# Altium project rf_detector.PrjPcb (part 1 of 4)
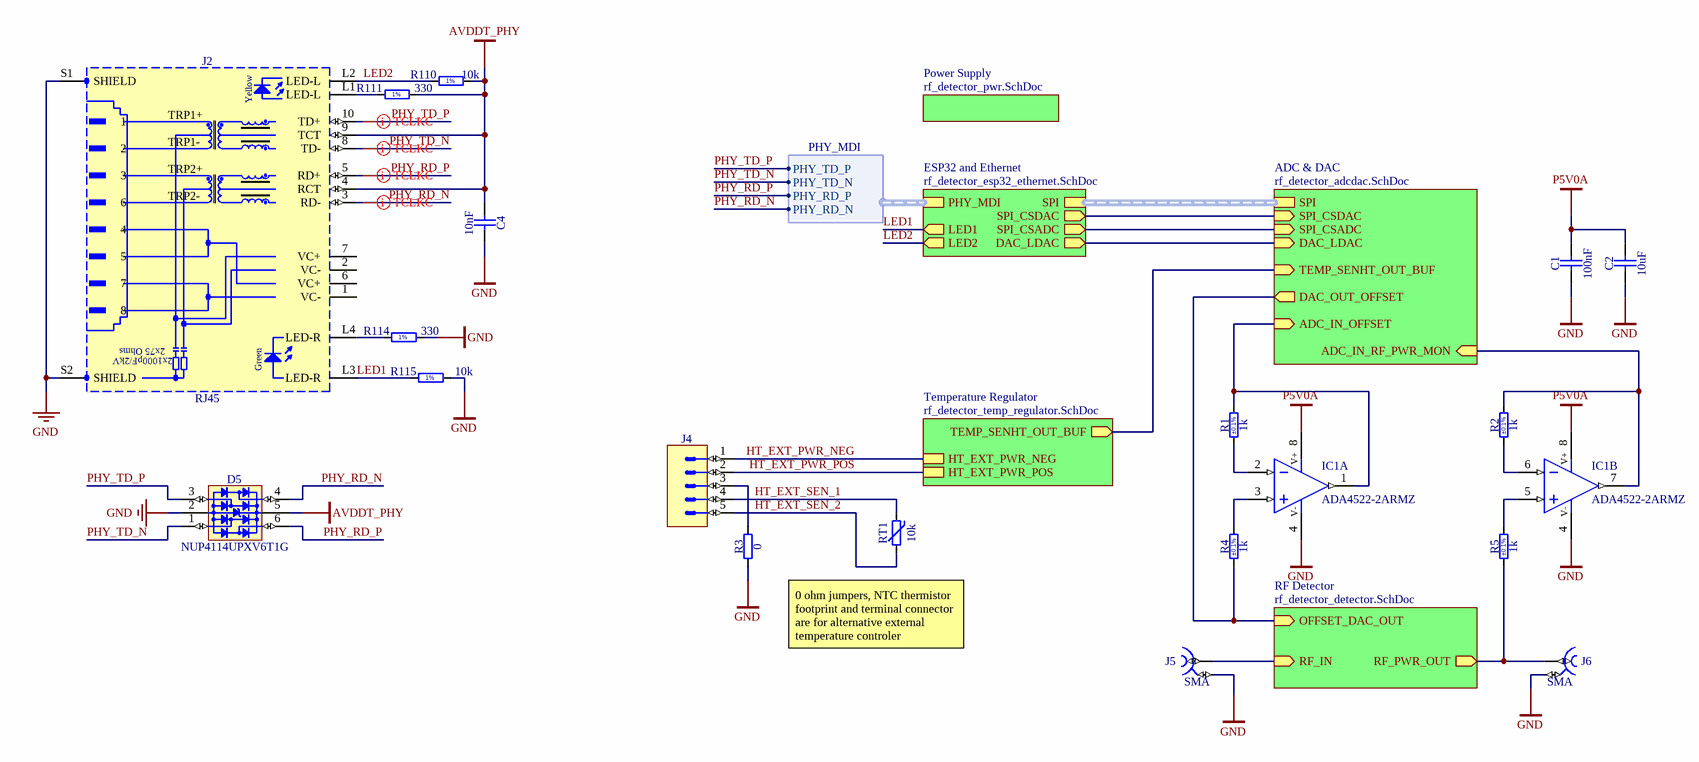
[diagram p0: rf_detector_top.SchDoc]
6 sheets, 329 parts. Net scope: hierarchical (ports join the sheet entries above them; power ports are global).
Board file: rf_detector.PcbDoc
Sheets:
  rf_detector_top.SchDoc
    ADC & DAC = rf_detector_adcdac.SchDoc
    RF Detector = rf_detector_detector.SchDoc
    ESP32 and Ethernet = rf_detector_esp32_ethernet.SchDoc
    Power Supply = rf_detector_pwr.SchDoc
    Temperature Regulator = rf_detector_temp_regulator.SchDoc

## Sheet rf_detector_top.SchDoc: SPE Router
size 420 x 297 mm; Author: P. Daniel; CompanyName: WUT ISE; DrawnBy: P. Daniel; Organization: WUT ISE; Address1: WUT ISE; Address2: Nowowiejska 15/19 00-665 Warsaw; Address3: piotrmaciejdaniel@gmail.com; Revision: 1; SheetNumber: 1; SheetTotal: 6; ModifiedBy: -; CreateDate: 02-03.2023; CheckedDate: -; Title2: top schematic; DivGrp: WUT ISE; Designer: Piotr Daniel

### Parts
C1  100nF  [CAPC1005X55N]
C2  10uF  [CAPC2012X135N]
C4  10nF  [CAPC1608X87N]
D5  NUP4114UPXV6T1G  [SOTFL50P160X60-6N]
IC1  ADA4522-2ARMZ  [SOP65P490X110-8N]  (parts A,B of 2)
J2  RJ45  [ABRACON_ARJM11C7-114-BA-EW2]
J4  (no value)  [PHOENIX_1803303]
J5  SMA  [MOLEX_73251-2121]
J6  SMA  [MOLEX_73251-2121]
R1  1k  Tolerance: ±0.1%  [RESC1608X55N]
R2  1k  Tolerance: ±0.1%  [RESC1608X55N]
R3  0  [RESC2012X60N]
R4  1k  Tolerance: ±0.1%  [RESC1608X55N]
R5  1k  Tolerance: ±0.1%  [RESC1608X55N]
R110  10k  [RESC1005X40N]
R111  330  [RESC1005X40N]
R114  330  [RESC1005X40N]
R115  10k  [RESC1005X40N]
RT1  10k  [THERMC1608X90N]

### Sub-sheets
ADC & DAC = rf_detector_adcdac.SchDoc: TEMP_SENHT_OUT_BUF (in), DAC_OUT_OFFSET (out), ADC_IN_OFFSET (in), ADC_IN_RF_PWR_MON (in), SPI (harness PHY_MDI), SPI_CSDAC (in), SPI_CSADC (in), DAC_LDAC (in)
ESP32 and Ethernet = rf_detector_esp32_ethernet.SchDoc: SPI_CSDAC (out), SPI_CSADC (out), DAC_LDAC (out), PHY_MDI (harness PHY_MDI), SPI (harness PHY_MDI), LED2 (out), LED1 (out)
Power Supply = rf_detector_pwr.SchDoc: no entries
RF Detector = rf_detector_detector.SchDoc: OFFSET_DAC_OUT (in), RF_IN (in), RF_PWR_OUT (out)
Temperature Regulator = rf_detector_temp_regulator.SchDoc: TEMP_SENHT_OUT_BUF (out), HT_EXT_PWR_POS, HT_EXT_PWR_NEG

### Harnesses
PHY_MDI: PHY_TD_P, PHY_TD_N, PHY_RD_P, PHY_RD_N

### Nets
AVDDT_PHY: C4.2 D5.5(VBUS) J2.4(RCT) J2.9(TCT) R110.1 R111.1
GND: C1.1 C2.1 C4.1 D5.2(GND) IC1.4(V-) J2.S1(SHIELD) J2.S2(SHIELD) J5.2 J6.2 R3.1 R114.1 R115.1
P5V0A: C1.2 C2.2 IC1.8(V+)
ADC_IN_OFFSET: IC1.1(OUT) R1.2 ; sheet ADC & DAC/ADC_IN_OFFSET
ADC_IN_RF_PWR_MON: IC1.7(OUT) R2.2 ; sheet ADC & DAC/ADC_IN_RF_PWR_MON
DAC_LDAC: sheet ADC & DAC/DAC_LDAC, sheet ESP32 and Ethernet/DAC_LDAC
DAC_OUT_OFFSET: R4.1 ; sheet ADC & DAC/DAC_OUT_OFFSET, sheet RF Detector/OFFSET_DAC_OUT
HT_EXT_PWR_NEG: J4.1 ; sheet Temperature Regulator/HT_EXT_PWR_NEG
HT_EXT_PWR_POS: J4.2 ; sheet Temperature Regulator/HT_EXT_PWR_POS
HT_EXT_SEN_1: J4.4 RT1.2
HT_EXT_SEN_2: J4.5 RT1.1
LED1: J2.L3(LED-R) R115.2 ; sheet ESP32 and Ethernet/LED1
LED2: J2.L2(LED-L) R110.2 ; sheet ESP32 and Ethernet/LED2
PHY_RD_N: D5.4(I/O3) J2.3(RD-) ; sheet ESP32 and Ethernet/PHY_MDI.PHY_RD_N
PHY_RD_P: D5.6(I/O4) J2.5(RD+) ; sheet ESP32 and Ethernet/PHY_MDI.PHY_RD_P
PHY_TD_N: D5.1(I/O1) J2.8(TD-) ; sheet ESP32 and Ethernet/PHY_MDI.PHY_TD_N
PHY_TD_P: D5.3(I/O2) J2.10(TD+) ; sheet ESP32 and Ethernet/PHY_MDI.PHY_TD_P
RF_IN: J5.1 ; sheet RF Detector/RF_IN
RF_PWR_OUT: J6.1 R5.1 ; sheet RF Detector/RF_PWR_OUT
SPI_CSADC: sheet ADC & DAC/SPI_CSADC, sheet ESP32 and Ethernet/SPI_CSADC
SPI_CSDAC: sheet ADC & DAC/SPI_CSDAC, sheet ESP32 and Ethernet/SPI_CSDAC
TEMP_SENHT_OUT_BUF: sheet ADC & DAC/TEMP_SENHT_OUT_BUF, sheet Temperature Regulator/TEMP_SENHT_OUT_BUF
NetIC1_2: IC1.2(IN-) R1.1
NetIC1_3: IC1.3(IN+) R4.2
NetIC1_5: IC1.5(IN+) R5.2
NetIC1_6: IC1.6(IN-) R2.1
NetJ2_L1: J2.L1(LED-L) R111.2
NetJ2_L4: J2.L4(LED-R) R114.2
NetJ4_3: J4.3 R3.2

Not connected (* = marked no-connect by the designer): J2 1(VC-) 2(VC-) 6(VC+) 7(VC+)

### Buses and harness runs
harness sheet ADC & DAC/SPI = sheet ESP32 and Ethernet/SPI

### Layout directives
differential pair; differential pair class Ethernet; net class Ethernet: PHY_RD_N, PHY_RD_P, PHY_TD_N, PHY_TD_P

### Notes on the sheet
- 0 ohm jumpers, NTC thermistor footprint and terminal connector are for alternative external temperature controler
- Project/Equipment
- Document
- Designer
- Drawn by
- Check.by
- Copyright WUT ISE 2021.
  This documentation describes Open Hardware and is licensed under the CERN OHL v.1.1. You may redistribute and modify this documentation under the terms of the CERN OHL v.1.1. (http://ohwr.org/CERNOHL). This documentation is distributed WITHOUT ANY EXPRESS OR IMPLIED WARRANTY, INCLUDING OF MERCHANTABILITY, SATISFACTORY QUALITY AND FITNESS FOR A PARTICULAR PURPOSE. Please see the CERN OHL v.1.1 for applicable conditions.
- Contact
- File
- Last Mod.
- Print Date
- Sheet
- Size
- A3
- of
- Rev
- (in symbol CON_ETH_POE_ARJM11C7) Yellow; TRP1+; TRP1-; TRP2+; TRP2-; 2x75 Ohms; Green; 2x1000pF/2kV
- (in symbol R0402_10K_1%_0.0625W_100PPM) 1%
- (in symbol R0402_330R_1%_0.0625W_100PPM) 1%

### Library data of the parts
C1 = CC0402_100NF_16V_10%_X7R: Non-polarised capacitor; Part Description: SMD Multilayer Chip Ceramic Capacitor; Manufacturer: GENERIC; Manufacturer1 Part Number: GRM155R71C104KA88D; Voltage: 16V; TC: X7R; Tolerance: ±10%; Part Number: CC0402_100NF_16V_10%_X7R; Component Kind: Standard; Component Type: Standard; Pin Count: 2; Value: 100nF; Status: Not Recommended; Manufacturer Part Number: CC0402_100NF_16V_10%_X7R; Case: 0402; Mounted: Yes; Socket: No; SMD: Yes; Sense: No; Manufacturer1 Example: MURATA; Manufacturer1 ComponentHeight: 0.55mm; HelpURL: \\cern.ch\dfs\Applications\Altium\Datasheets\CC0402_X7R_MURATA_GRM.pdf; Author: CERN DEM JLC; CreateDate: 05.12.2013; LatestRevisionDate: 03.12.2007
C2 = CC0805_10UF_10V_10%_X7R: Non-polarised capacitor; Part Description: SMD Multilayer Chip Ceramic Capacitor; Manufacturer: GENERIC; Manufacturer1 Part Number: GRM21BR71A106KE51L; Voltage: 10V; TC: X7R; Tolerance: ±10%; Part Number: CC0805_10UF_10V_10%_X7R; Component Kind: Standard; Component Type: Standard; Pin Count: 2; Value: 10uF; Status: Preferred; Manufacturer Part Number: CC0805_10UF_10V_10%_X7R; Case: 0805; Mounted: Yes; Socket: No; SMD: Yes; Sense: No; Manufacturer1 Example: MURATA; Manufacturer1 ComponentHeight: 1.35mm; HelpURL: \\cern.ch\dfs\Applications\Altium\Datasheets\CC0805_X7R_MURATA.pdf; Author: CERN DEM JLC; CreateDate: 30.04.2012; LatestRevisionDate: 30.04.2012
C4 = CC0603_10NF_50V_5%_C0G: Non-polarised capacitor; Part Description: SMD Multilayer Chip Ceramic Capacitor; Manufacturer: GENERIC; Manufacturer1 Part Number: C1608C0G1H103J080AA; Voltage: 50V; TC: C0G/NP0; Tolerance: ±5%; Part Number: CC0603_10NF_50V_5%_C0G; Component Kind: Standard; Component Type: Standard; Pin Count: 2; Value: 10nF; Status: Preferred; Manufacturer Part Number: CC0603_10NF_50V_5%_C0G; Case: 0603; Mounted: Yes; Socket: No; SMD: Yes; Sense: No; Manufacturer1 Example: TDK; Manufacturer1 ComponentHeight: 0.9mm; HelpURL: \\cern.ch\dfs\Applications\Altium\Datasheets\CC0603_C0G_TDK_C.pdf; Author: CERN DEM JLC; CreateDate: 10.12.2014; LatestRevisionDate: 10.12.2014
D5 = NUP4114UPXV6T1G: Part Description: ESD Protection Diodes Array (8kV) with Low Clamping Voltage; Manufacturer: ON SEMICONDUCTOR; Voltage: 5.5V; PressFit: No; Bonding: No; Part Number: NUP4114UPXV6T1G; Component Kind: Standard; Component Type: Standard; Device: NUP4114UPXV6T1G; PackageDescription: SOTFL (SOT666, SOT563,), 0.50mm, Pitch; 6 Pin, 1.20mm W X 1.60mm L X 0.60mm H Body, IPC Medium Density; Manufacturer Part Number: NUP4114UPXV6T1G; Pin Count: 8; Mounted: Yes; Socket: No; SMD: Yes; Sense: No; ComponentHeight: 1.75mm; HelpURL: \\cern.ch\dfs\Applications\Altium\Datasheets\NUP4114UPXV6T1G.pdf; Author: CERN DEM JLC; CreateDate: 05.12.2012; LatestRevisionDate: 05.12.2012
IC1 = ADA4522-2ARMZ: Dual Operational Amplifier; Part Description: 55V, EMI Enhanced, Zero Drift, Ultralow Noise, Dual Rail-to-Rail Output Operational Amplifier; Manufacturer: ANALOG DEVICES; PressFit: No; Bonding: No; Part Number: ADA4522-2ARMZ; Component Kind: Standard; Component Type: Standard; Device: ADA4522-2ARMZ; PackageDescription: SOP, 0.65mm Pitch; 8 Pin, 3.00mm W X 3.00mm L X 1.10mm H body, IPC Medium Density; Manufacturer Part Number: ADA4522-2ARM; Pin Count: 8; Case: MSOP8; Mounted: Yes; Socket: No; SMD: Yes; Sense: No; ComponentHeight: 1.1mm; Author: CERN DEM BC; HelpURL: \\cern.ch\dfs\Applications\Altium\Datasheets\ADA4522-2ARMZ.pdf; CreateDate: 28.07.2017; LatestRevisionDate: 31.03.2022
J2 = CON_ETH_POE_ARJM11C7: MagJack 10/100BaseT, PoE+, 1X1, OG/Y, -40 to 85*C, Tab Up, RoHS; Part Number: ARJM11C7-114-BA-EW2; Part Description: 1 Port, Orange Green/Yellow LEDs, RJ45 10/100BaseT, PoE, Ethernet MagJack® Connector Module; Manufacturer: Abracon; PressFit: No; Component Kind: Standard; Component Type: Standard; Pin Count: 18; Family: RJ45; Mounted: Yes; Socket: No; SMD: No; Sense: No; Status: None; Manufacturer Part Number: ARJM11C7-114-BA-EW2; ComponentHeight: 13.61mm; HelpURL: \\cern.ch\dfs\Applications\Altium\Datasheets\BELFUSE_0826-1X1T-GJ-F.pdf; Author: GK; CreateDate: 05.11.2012; LatestRevisionDate: 05.11.2012
J4 = PHOENIX_1803303: Connector 5 Male; Part Description: 8A 160 V, Pitch: 3.81mm, 5 Positions  Right Angled Header; Manufacturer: PHOENIX CONTACT; Manufacturer Part Number: 1803303 (MC 1,5/ 5-G-3,81); PressFit: No; Part Number: PHOENIX_1803303; Component Kind: Standard; Component Type: Standard; Pin Count: 5; Mounted: Yes; Socket: No; SMD: No; Sense: No; Status: None; ComponentHeight: 7.25mm; HelpURL: \\cern.ch\dfs\Applications\Altium\Datasheets\PHOENIX_1803303.pdf; Author: CERN DEM JLC; CreateDate: 11.06.2013; LatestRevisionDate: 11.06.2013
J5 J6 = MOLEX_73251-2121: Part Description: 50 Ohm, SMA Edge Mount PCB, With Jam Nut And Lock Washer; Manufacturer: MOLEX; PressFit: No; Part Number: MOLEX_73251-2121; Component Kind: Standard; Component Type: Standard; Pin Count: 5; Family: SMA; Mounted: Yes; Socket: No; SMD: No; Sense: No; Status: None; Manufacturer Part Number: 73251-2121; ComponentHeight: 5.75mm; HelpURL: \\cern.ch\dfs\Applications\Altium\Datasheets\MOLEX_73251-2121.pdf; Author: CERN DEM JLC; CreateDate: 26.10.2016; LatestRevisionDate: 27.03.2017
R1 R2 R4 R5 = R0603_1K_0.1%_0.063W_10PPM: Resistor - 0.1%; Part Description: Thin Film Chip Resistor; Manufacturer: GENERIC; Manufacturer1 Part Number: RN73C1J1K0BTG; Power: 0.063W; TC: ±10ppm; PressFit: No; Part Number: R0603_1K_0.1%_0.063W_10PPM; Component Kind: Standard; Component Type: Standard; Pin Count: 2; Value: 1k; Status: Not Recommended; Manufacturer Part Number: R0603_1K_0.1%_0.063W_10PPM; Case: 0603; Mounted: Yes; Sense: No; Socket: No; SMD: Yes; Manufacturer1 Example: TYCO HOLSWORTHY; Manufacturer1 ComponentHeight: 0.55mm; HelpURL: \\cern.ch\dfs\Applications\Altium\Datasheets\R0603_Tyco_RN73.pdf; Author: CERN DEM BC; CreateDate: 23.05.2016; LatestRevisionDate: 23.05.2016
R3 = R0805_0R_JUMPER: Resistor; Part Description: 2A (0.05R Max DC Resistance) Zero Ohm Jumper; Manufacturer: GENERIC; Manufacturer1 Part Number: NRC10Z0; PressFit: No; Part Number: R0805_0R_JUMPER; Component Kind: Standard; Component Type: Standard; Pin Count: 2; Value: 0; Status: Preferred; Manufacturer Part Number: R0805_0R_JUMPER; Case: 0805; Mounted: Yes; Sense: No; Socket: No; SMD: Yes; Manufacturer1 Example: NIC COMPONENT; Manufacturer1 ComponentHeight: 0.6mm; HelpURL: \\cern.ch\dfs\Applications\Altium\Datasheets\R0805_NIC_NRC.pdf; Author: CERN DEM JLC; CreateDate: 03.12.2007; LatestRevisionDate: 13.03.2008
R110 R115 = R0402_10K_1%_0.0625W_100PPM: Resistor - 1%; Part Description: General Purpose Thick Film Chip Resistor; Manufacturer: GENERIC; Manufacturer1 Part Number: 232270671003L; TC: ±100ppm/°C; Table: Resistors SMD; Part Number: R0402_10K_1%_0.0625W_100PPM; Component Kind: Standard; Component Type: Standard; Pin Count: 2; Value: 10k; Status: Not recommended; Power: 0.0625W; Tolerance: ±1%; Manufacturer Part Number: R0402_10K_1%_0.0625W_100PPM; Case: 0402; Mounted: Yes; Socket: No; SMD: Yes; Manufacturer1 Example: YAGEO PHYCOMP; Manufacturer1 ComponentHeight: 0.4mm; HelpURL: \\cern.ch\dfs\Applications\Altium\Datasheets\R0402_Phycomp_RC0402.pdf; Author: CERN DEM JLC; CreateDate: 2007-12-03; LatestRevisionDate: 2012-10-17
R111 R114 = R0402_330R_1%_0.0625W_100PPM: Resistor - 1%; Part Description: General Purpose Thick Film Chip Resistor; Manufacturer: GENERIC; Manufacturer1 Part Number: 232270673301L; TC: ±100ppm/°C; PressFit: No; Part Number: R0402_330R_1%_0.0625W_100PPM; Component Kind: Standard; Component Type: Standard; Pin Count: 2; Value: 330; Status: Not Recommended; Power: 0.0625W; Tolerance: ±1%; Manufacturer Part Number: R0402_330R_1%_0.0625W_100PPM; Case: 0402; Mounted: Yes; Sense: No; Socket: No; SMD: Yes; Manufacturer1 Example: YAGEO PHYCOMP; Manufacturer1 ComponentHeight: 0.4mm; HelpURL: \\cern.ch\dfs\Applications\Altium\Datasheets\R0402_Phycomp_RC0402.pdf; Author: CERN DEM JLC; CreateDate: 03.12.2007; LatestRevisionDate: 17.10.2012
RT1 = THERM_NTC_10K_EPCOS_B57330V2103J260: Thermistor NTC (Negative Temperature Coefficient); Part Description: SMD NTC Thermistor for Temperature Measurement; Manufacturer: EPCOS / TDK; Power: 180mW; Tolerance: ±5%; Part Number: THERM_NTC_10K_EPCOS_B57330V2103J260; Component Kind: Standard; Component Type: Standard; Pin Count: 2; Value: 10k; Status: None; Manufacturer Part Number: B57330V2103J260; Case: 0603; Mounted: Yes; Socket: No; SMD: Yes; Sense: No; ComponentHeight: 0.9mm; HelpURL: \\cern.ch\dfs\Applications\Altium\Datasheets\THERM_EPCOS_B573xxV2.pdf; Author: CERN DEM BC; CreateDate: 30.07.2015; LatestRevisionDate: 30.07.2015

## Sheet rf_detector_adcdac.SchDoc: SPE Router
size 420 x 297 mm; Author: P. Daniel; CompanyName: WUT ISE; DrawnBy: P. Daniel; Organization: WUT ISE; Address1: WUT ISE; Address2: Nowowiejska 15/19 00-665 Warsaw; Address3: piotrmaciejdaniel@gmail.com; Revision: 1; SheetNumber: 3; SheetTotal: 6; ModifiedBy: -; CreateDate: 02-03.2023; CheckedDate: -; Title2: PoE power supply; DivGrp: WUT ISE; Designer: Piotr Daniel
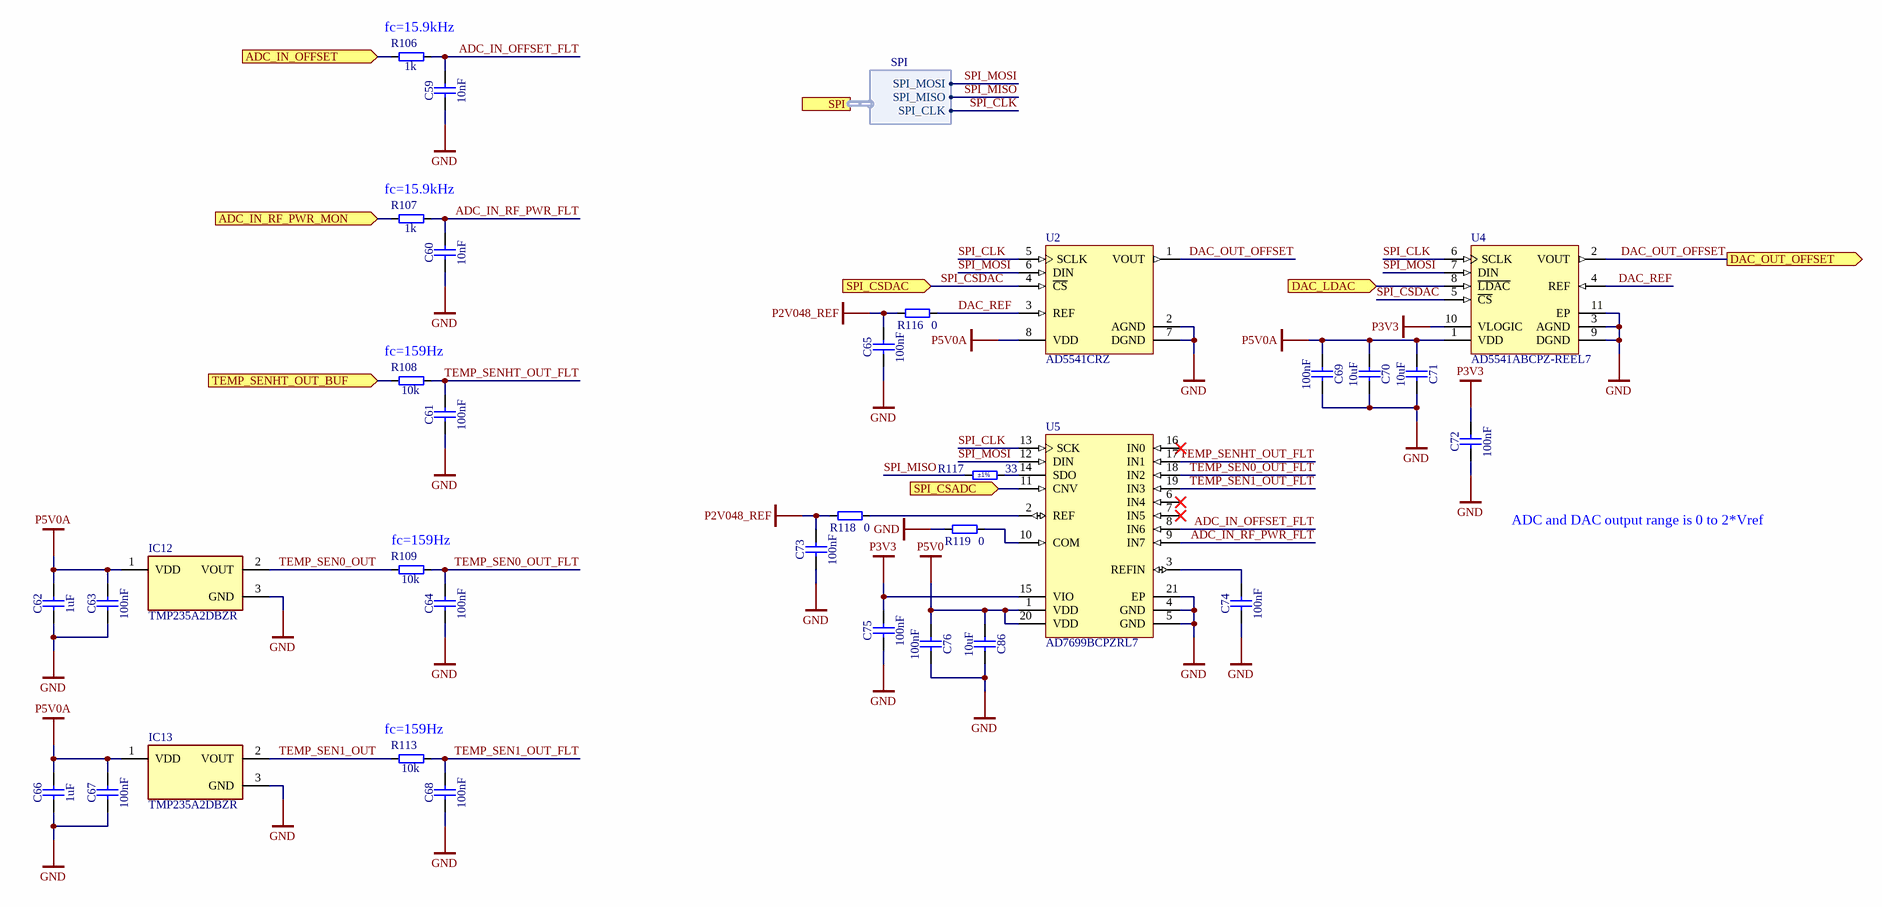
[diagram p1: rf_detector_adcdac.SchDoc]

### Parts
C59  10nF  [CAPC1005X55N]
C60  10nF  [CAPC1005X55N]
C61  100nF  [CAPC1005X55N]
C62  1uF  [CAPC1608X87N]
C63  100nF  [CAPC1005X55N]
C64  100nF  [CAPC1005X55N]
C65  100nF  [CAPC1005X55N]
C66  1uF  [CAPC1608X87N]
C67  100nF  [CAPC1005X55N]
C68  100nF  [CAPC1005X55N]
C69  100nF  [CAPC1005X55N]
C70  10uF  [CAPC2012X135N]
C71  10uF  [CAPC2012X135N]
C72  100nF  [CAPC1005X55N]
C73  100nF  [CAPC1005X55N]
C74  100nF  [CAPC1005X55N]
C75  100nF  [CAPC1005X55N]
C76  100nF  [CAPC1005X55N]
C86  10uF  [CAPC2012X135N]
IC12  TMP235A2DBZR  [FP-DBZ0003A-MFG]
IC13  TMP235A2DBZR  [FP-DBZ0003A-MFG]
R106  1k  [RESC1005X40N]
R107  1k  [RESC1005X40N]
R108  10k  [RESC1005X40N]
R109  10k  [RESC1005X40N]
R113  10k  [RESC1005X40N]
R116  0  [RESC1005X40N]
R117  33  Tolerance: ±1%  [RESC1005X40N]
R118  0  [RESC1005X40N]
R119  0  [RESC1005X40N]
U2  AD5541CRZ  [R-8_N]
U4  AD5541ABCPZ-REEL7  [CP-10-9_L]
U5  AD7699BCPZRL7  [CP-20-4_M]

### Ports
ADC_IN_OFFSET (in), ADC_IN_RF_PWR_MON (in), DAC_LDAC (in), DAC_OUT_OFFSET (out), SPI (harness SPI), SPI_CSADC (in), SPI_CSDAC (in), TEMP_SENHT_OUT_BUF (in)

### Harnesses
SPI: SPI_MOSI, SPI_MISO, SPI_CLK

### Nets
GND: C59.1 C60.1 C61.1 C62.1 C63.1 C64.1 C65.1 C66.1 C67.1 C68.1 C69.1 C70.1 C71.1 C72.1 C73.1 C74.1 C75.1 C76.1 C86.1 IC12.3(GND) IC13.3(GND) R119.2 U2.2(AGND) U2.7(DGND) U4.3(AGND) U4.9(DGND) U4.11(EP) U5.4(GND) U5.5(GND) U5.21(EP)
P2V048_REF: C65.2 C73.2 R116.2 R118.2
P3V3: C72.2 C75.2 U4.10(VLOGIC) U5.15(VIO)
P5V0: C76.2 C86.2 U5.1(VDD) U5.20(VDD)
P5V0A: C62.2 C63.2 C66.2 C67.2 C69.2 C70.2 C71.2 IC12.1(VDD) IC13.1(VDD) U2.8(VDD) U4.1(VDD)
ADC_IN_OFFSET: R106.1 ; port ADC_IN_OFFSET
ADC_IN_OFFSET_FLT: C59.2 R106.2 U5.8(IN6)
ADC_IN_RF_PWR_FLT: C60.2 R107.2 U5.9(IN7)
ADC_IN_RF_PWR_MON: R107.1 ; port ADC_IN_RF_PWR_MON
DAC_LDAC: U4.8(~{LDAC}) ; port DAC_LDAC
DAC_OUT_OFFSET: U2.1(VOUT) U4.2(VOUT) ; port DAC_OUT_OFFSET
DAC_REF: R116.1 U2.3(REF) U4.4(REF)
SPI_CLK: U2.5(SCLK) U4.6(SCLK) U5.13(SCK) ; port SPI.SPI_CLK
SPI_CSADC: U5.11(CNV) ; port SPI_CSADC
SPI_CSDAC: U2.4(~{CS}) U4.5(~{CS}) ; port SPI_CSDAC
SPI_MISO: R117.1 ; port SPI.SPI_MISO
SPI_MOSI: U2.6(DIN) U4.7(DIN) U5.12(DIN) ; port SPI.SPI_MOSI
TEMP_SEN0_OUT: IC12.2(VOUT) R109.1
TEMP_SEN0_OUT_FLT: C64.2 R109.2 U5.18(IN2)
TEMP_SEN1_OUT: IC13.2(VOUT) R113.1
TEMP_SEN1_OUT_FLT: C68.2 R113.2 U5.19(IN3)
TEMP_SENHT_OUT_BUF: R108.1 ; port TEMP_SENHT_OUT_BUF
TEMP_SENHT_OUT_FLT: C61.2 R108.2 U5.17(IN1)
NetC74_2: C74.2 U5.3(REFIN)
NetR117_2: R117.2 U5.14(SDO)
NetR118_1: R118.1 U5.2(REF)
NetR119_1: R119.1 U5.10(COM)

Not connected (* = marked no-connect by the designer): U5 6(IN4)* 7(IN5)* 16(IN0)*

### Notes on the sheet
- (near R106) fc=15.9kHz
- (near R107) fc=15.9kHz
- (near R108) fc=159Hz
- (near R109) fc=159Hz
- ADC and DAC output range is 0 to 2*Vref
- (near R113) fc=159Hz
- Project/Equipment
- Document
- Designer
- Drawn by
- Check.by
- Copyright WUT ISE 2021.
  This documentation describes Open Hardware and is licensed under the CERN OHL v.1.1. You may redistribute and modify this documentation under the terms of the CERN OHL v.1.1. (http://ohwr.org/CERNOHL). This documentation is distributed WITHOUT ANY EXPRESS OR IMPLIED WARRANTY, INCLUDING OF MERCHANTABILITY, SATISFACTORY QUALITY AND FITNESS FOR A PARTICULAR PURPOSE. Please see the CERN OHL v.1.1 for applicable conditions.
- Contact
- File
- Last Mod.
- Print Date
- Sheet
- Size
- A3
- of
- Rev

### Library data of the parts
C59 C60 = CC0402_10NF_25V_10%_X7R: Non-polarised capacitor; Part Description: SMD Multilayer Chip Ceramic Capacitor; Manufacturer: GENERIC; Manufacturer1 Part Number: C1005X7R1E103K050; Voltage: 25V; TC: X7R; Tolerance: ±10%; Part Number: CC0402_10NF_25V_10%_X7R; Component Kind: Standard; Component Type: Standard; Pin Count: 2; Value: 10nF; Status: Preferred; Manufacturer Part Number: CC0402_10NF_25V_10%_X7R; Case: 0402; Mounted: Yes; Socket: No; SMD: Yes; Sense: No; Manufacturer1 Example: TDK; Manufacturer1 ComponentHeight: 0.55mm; HelpURL: \\cern.ch\dfs\Applications\Altium\Datasheets\CC0402_X7R_TDK_C.pdf; Author: CERN DEM JLC; CreateDate: 25.10.2012; LatestRevisionDate: 25.10.2012
C61 C63-C65 C67-C69 C72-C76 = CC0402_100NF_16V_10%_X7R: as C1 on sheet rf_detector_top; Part Number: CC0402_100NF_16V_10%_X7R; Component Kind: Standard; Component Type: Standard; Pin Count: 2; Value: 100nF; Status: Not Recommended; Manufacturer Part Number: CC0402_100NF_16V_10%_X7R; Case: 0402; Mounted: Yes; Socket: No; SMD: Yes; Sense: No; Manufacturer1 Example: MURATA; Manufacturer1 ComponentHeight: 0.55mm; HelpURL: \\cern.ch\dfs\Applications\Altium\Datasheets\CC0402_X7R_MURATA_GRM.pdf; Author: CERN DEM JLC; CreateDate: 05.12.2013; LatestRevisionDate: 03.12.2007
C62 C66 = CC0603_1UF_25V_10%_X7R: Non-polarised capacitor; Part Description: SMD Multilayer Chip Ceramic Capacitor; Manufacturer: GENERIC; Manufacturer1 Part Number: GRM188R71E105KA12D; Voltage: 25V; TC: X7R; Tolerance: ±10%; Part Number: CC0603_1UF_25V_10%_X7R; Component Kind: Standard; Component Type: Standard; Pin Count: 2; Value: 1uF; Status: None; Manufacturer Part Number: CC0603_1UF_25V_10%_X7R; Case: 0603; Mounted: Yes; Socket: No; SMD: Yes; Sense: No; Manufacturer1 Example: MURATA; Manufacturer1 ComponentHeight: 0.9mm; HelpURL: \\cern.ch\dfs\Applications\Altium\Datasheets\CC0603_X7R_MURATA.pdf; Author: CERN DEM JLC; CreateDate: 18.01.2011; LatestRevisionDate: 18.01.2011
C70 C71 C86 = CC0805_10UF_10V_10%_X7R: as C2 on sheet rf_detector_top; Part Number: CC0805_10UF_10V_10%_X7R; Component Kind: Standard; Component Type: Standard; Pin Count: 2; Value: 10uF; Status: Preferred; Manufacturer Part Number: CC0805_10UF_10V_10%_X7R; Case: 0805; Mounted: Yes; Socket: No; SMD: Yes; Sense: No; Manufacturer1 Example: MURATA; Manufacturer1 ComponentHeight: 1.35mm; HelpURL: \\cern.ch\dfs\Applications\Altium\Datasheets\CC0805_X7R_MURATA.pdf; Author: CERN DEM JLC; CreateDate: 30.04.2012; LatestRevisionDate: 30.04.2012
IC12 IC13 = CMP-04948-000003-1: LOW-POWER HIGH-ACCURACY ANALOG O; Manufacturer: Texas Instruments; Output Current: 500uA; Operating Supply Current: 9uA; Max Supply Voltage: 5.5V; Max Junction Temp: +150°C; Accuracy: 0.5%; Min Supply Voltage: 2.3V; Standoff Height: 0.01mm; Sensor Output: Analog Voltage; Ambient Temperature Range Low: -40°C; Device Class L2: Temperature and Humidity Sensors; Digikey Description: LOW-POWER HIGH-ACCURACY ANALOG O; Lead Free: Yes; Category: IC; Device Class L3: unset; Temperature Range Low: -40°C; Manufacturer Part Number: TMP235A2DBZR; ComponentLink2Description: Datasheet; Package: DBZ0003A; Octopart: https://octopart.com/tmp235a2dbzr-texas+instruments-94966376; Device Class L1: Sensors; Temperature Range High: +150°C; Height: 1.12mm; Temperature: -40°C to +150°C; RoHS: TRUE; Ambient Temperature Range High: +150°C; Automotive: No; ComponentLink2URL: http://www.ti.com/lit/ds/symlink/tmp235.pdf; Mouser Description: ±2°C Analog output temperature sensor, with 10mV /°C gain 3-SOT-23 -40 to 150; Part Number: TMP235A2DBZR
R106 R107 = R0402_1K_1%_0.0625W_100PPM: Resistor - 1%; Part Description: General Purpose Thick Film Chip Resistor; Manufacturer: GENERIC; Manufacturer1 Part Number: 232270671002L; TC: ±100ppm/°C; PressFit: No; Part Number: R0402_1K_1%_0.0625W_100PPM; Component Kind: Standard; Component Type: Standard; Pin Count: 2; Value: 1k; Status: Not Recommended; Power: 0.0625W; Tolerance: ±1%; Manufacturer Part Number: R0402_1K_1%_0.0625W_100PPM; Case: 0402; Mounted: Yes; Sense: No; Socket: No; SMD: Yes; Manufacturer1 Example: YAGEO PHYCOMP; Manufacturer1 ComponentHeight: 0.4mm; HelpURL: \\cern.ch\dfs\Applications\Altium\Datasheets\R0402_Phycomp_RC0402.pdf; Author: CERN DEM JLC; CreateDate: 03.12.2007; LatestRevisionDate: 17.10.2012
R108 R109 R113 = R0402_10K_1%_0.0625W_100PPM: Resistor - 1%; Part Description: General Purpose Thick Film Chip Resistor; Manufacturer: GENERIC; Manufacturer1 Part Number: 232270671003L; TC: ±100ppm/°C; PressFit: No; Part Number: R0402_10K_1%_0.0625W_100PPM; Component Kind: Standard; Component Type: Standard; Pin Count: 2; Value: 10k; Status: Not Recommended; Power: 0.0625W; Tolerance: ±1%; Manufacturer Part Number: R0402_10K_1%_0.0625W_100PPM; Case: 0402; Mounted: Yes; Sense: No; Socket: No; SMD: Yes; Manufacturer1 Example: YAGEO PHYCOMP; Manufacturer1 ComponentHeight: 0.4mm; HelpURL: \\cern.ch\dfs\Applications\Altium\Datasheets\R0402_Phycomp_RC0402.pdf; Author: CERN DEM JLC; CreateDate: 03.12.2007; LatestRevisionDate: 17.10.2012
R116 R118 R119 = R0402_0R_JUMPER: Resistor; Part Description: 1A (0.05R Max DC Resistance) Zero Ohm Jumper; Manufacturer: GENERIC; Manufacturer1 Part Number: 232270591001L; Part Number: R0402_0R_JUMPER; Component Kind: Standard; Component Type: Standard; Pin Count: 2; Value: 0; Status: Not recommended; Manufacturer Part Number: R0402_0R_JUMPER; Case: 0402; Mounted: Yes; Sense: No; Socket: No; SMD: Yes; Manufacturer1 Example: YAGEO PHYCOMP; Manufacturer1 ComponentHeight: 0.4mm; HelpURL: \\cern.ch\dfs\Applications\Altium\Datasheets\R0402_Phycomp_RC0402.pdf; Author: CERN DEM JLC; CreateDate: 03.12.2007; LatestRevisionDate: 17.10.2012
R117 = R0402_33R_1%_0.0625W_100PPM: Resistor - 1%; Part Description: General Purpose Thick Film Chip Resistor; Manufacturer: GENERIC; Manufacturer1 Part Number: 232270673309L; TC: ±100ppm/°C; PressFit: No; Part Number: R0402_33R_1%_0.0625W_100PPM; Component Kind: Standard; Component Type: Standard; Pin Count: 2; Value: 33; Status: Not Recommended; Power: 0.0625W; Manufacturer Part Number: R0402_33R_1%_0.0625W_100PPM; Case: 0402; Mounted: Yes; Sense: No; Socket: No; SMD: Yes; Manufacturer1 Example: YAGEO PHYCOMP; Manufacturer1 ComponentHeight: 0.4mm; HelpURL: \\cern.ch\dfs\Applications\Altium\Datasheets\R0402_Phycomp_RC0402.pdf; Author: CERN DEM JLC; CreateDate: 03.12.2007; LatestRevisionDate: 17.10.2012
U2 = CMP-0318-00925-2: Single 16-Bit Digital-to-Analog Converter with Serial Interface, 2.7 to 5.5 V, -40 to +85 degC, R-8, Pb-Free, Tube; Manufacturer: Analog Devices; Generic Part Number: AD5541; Max V+: 5.5V; Op Pwr Diss: 6.05mW; Settling Time: 1Âµs; # DAC Outputs: 1; Resolution (Bits): 16; Single Supply: Yes; ComponentLink3Description: Package Specification; Packing: Tube; Code_IPC: SOIC127P600-8; ComponentLink2Description: Datasheet; RoHS: Y; ComponentLink3URL: http://www.analog.com/static/imported-files/packages/PKG_PDF/SOIC_Narrow%20(R)/R_8.pdf; PackageVersion: 060506-A; Code_JEDEC: MS-012-AA; ComponentLink5Description: Reference Design URL; PackageReference: R-8; ComponentLink5URL: http://www.analog.com/en/digital-to-analog-converters/da-converters/ad5541/products/product.html#prod_cross_sell; ComponentLink4URL: http://www.analog.com/en/digital-to-analog-converters/da-converters/ad5541/products/product.html; ComponentLink1URL: http://www.analog.com/en/index.html; Mounting Technology: Surface Mount; PackageDescription: 8-Lead Standard Small Outline Package [SOIC_N] Narrow Body; ComponentLink2URL: http://www.analog.com/static/imported-files/data_sheets/AD5541_5542.pdf; PartNumber: AD5541CRZ; ComponentLink4Description: Product URL; DatasheetVersion: Rev.F; ComponentLink1Description: Manufacturer URL; RevisionNote: Component URL fixed
U4 = CMP-0318-01240-2: Single 16-Bit Voltage Output Digital-to-Analog Converter with Serial Interface, 2.7 to 5.5 V, -40 to +125 degC, CP-10-9, Pb-Free, Reel; Manufacturer: Analog Devices; Settling Time: 1Âµs; Single Supply: Yes; Max V+: 5.5V; Op Pwr Diss: 600ÂµW; Resolution (Bits): 16; # DAC Outputs: 1; ComponentLink2Description: Datasheet; ComponentLink1Description: Manufacturer URL; DatasheetVersion: Rev.A; ComponentLink3Description: Package Specification; Generic Part Number: AD5541A; ComponentLink4Description: Product URL; Mounting Technology: Surface Mount; ComponentLink3URL: http://www.analog.com/static/imported-files/packages/CP_10_9.pdf; RoHS: Y; PackageVersion: 02-27-2012-B; Packing: Reel; PackageDescription: 10-Lead Lead Frame Chip Scale Package [LFCSP_WD] 3 x 3 mm Body, Very Very Thin, Dual Lead; ComponentLink1URL: http://www.analog.com/en/index.html; RevisionNote: Component URL fixed; ComponentLink4URL: http://www.analog.com/en/digital-to-analog-converters/da-converters/ad5541a/products/product.html; ComponentLink2URL: http://www.analog.com/static/imported-files/data_sheets/AD5541A.pdf; PackageReference: CP-10-9; PartNumber: AD5541ABCPZ-REEL7
U5 = CMP-0313-00572-2: Octal 16-Bit PulSAR Analog-to-Digital Converter with Serial, SPI Interface, 500KSPS, -40 to +85 degC, CP-20-4, Pb-Free, Reel; Generic Part Number: AD7699; Manufacturer: Analog Devices; Resolution (Bits): 16; Interface: Ser, SPI; Throughput Rate (SPS): 500K; Channels: 8; ComponentLink2Description: Datasheet; ComponentLink1URL: http://www.analog.com/en/index.html; Packing: Reel; ComponentLink1Description: Manufacturer URL; ComponentLink4URL: http://www.analog.com/en/analog-to-digital-converters/ad-converters/ad7699/products/product.html; ComponentLink4Description: Product URL; PackageReference: CP-20-4; PartNumber: AD7699BCPZRL7; PackageVersion: 012508-B; ComponentLink3Description: Package Specification; PackageDescription: 20-Lead Lead Frame Chip Scale Package [LFCSP_VQ] 4 x 4 mm Body, Very Thin Quad; DatasheetVersion: Rev.B; Code_JEDEC: MO-220-VGGD-1; Mounting Technology: Surface Mount; RoHS: Y; ComponentLink3URL: http://www.analog.com/static/imported-files/packages/PKG_PDF/LFCSP(CP)/CP_20_4.pdf; ComponentLink2URL: http://www.analog.com/static/imported-files/data_sheets/AD7699.pdf

## Sheet rf_detector_detector.SchDoc: SPE Router
size 420 x 297 mm; Author: P. Daniel; CompanyName: WUT ISE; DrawnBy: P. Daniel; Organization: WUT ISE; Address1: WUT ISE; Address2: Nowowiejska 15/19 00-665 Warsaw; Address3: piotrmaciejdaniel@gmail.com; Revision: 1; SheetNumber: 5; SheetTotal: 6; ModifiedBy: -; CreateDate: 02-03.2023; CheckedDate: -; Title2: PoE power supply; DivGrp: WUT ISE; Designer: Piotr Daniel
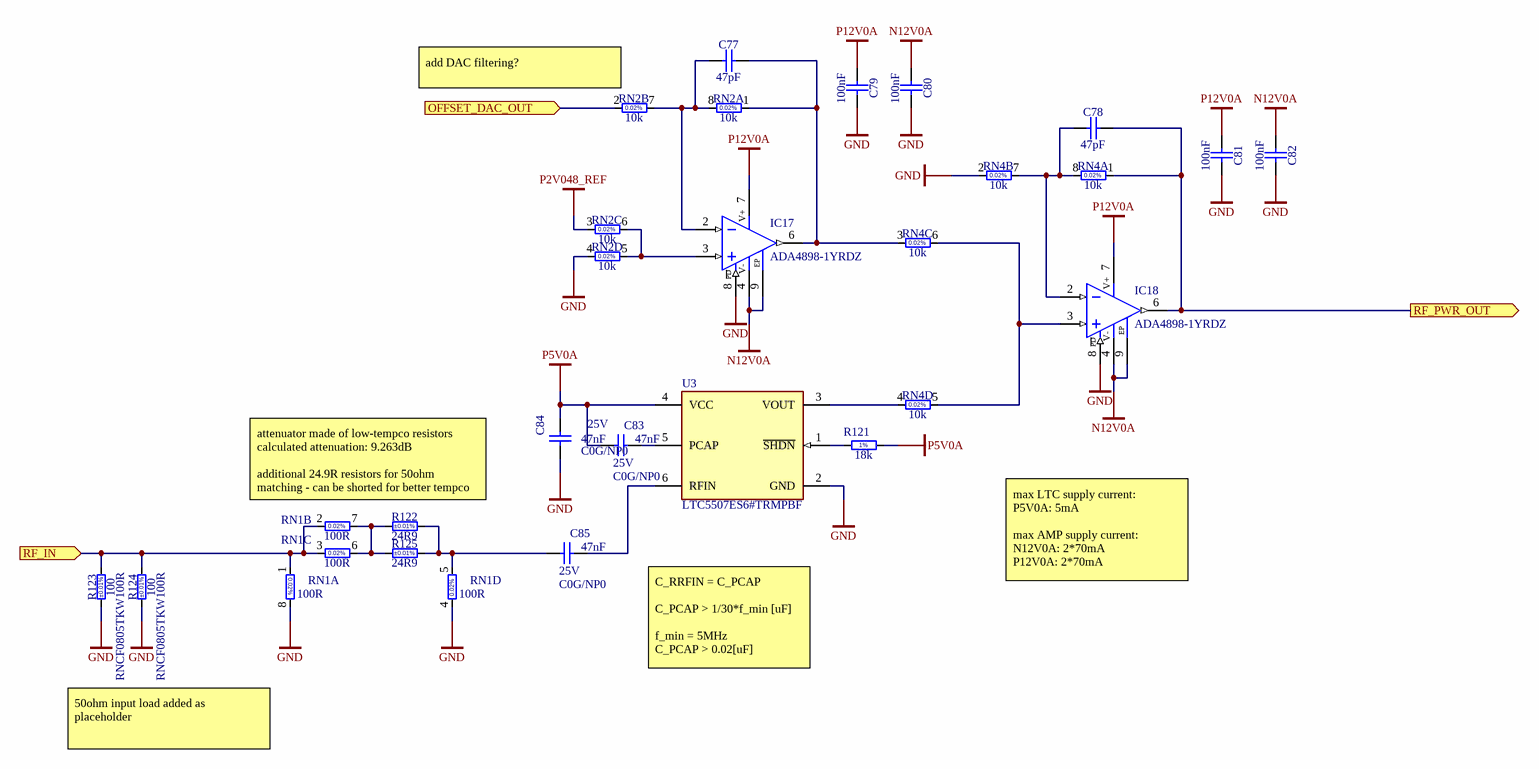
[diagram p2: rf_detector_detector.SchDoc]

### Parts
C77  47pF  [CAPC3216X94N]
C78  47pF  [CAPC3216X94N]
C79  100nF  [CAPC1005X55N]
C80  100nF  [CAPC1005X55N]
C81  100nF  [CAPC1005X55N]
C82  100nF  [CAPC1005X55N]
C83  47nF  Voltage: 25V  TC: C0G/NP0  [CAPC2012X135N]
C84  47nF  Voltage: 25V  TC: C0G/NP0  [CAPC2012X135N]
C85  47nF  Voltage: 25V  TC: C0G/NP0  [CAPC2012X135N]
IC17  ADA4898-1YRDZ  [SOIC127P600X175-9N-S229]
IC18  ADA4898-1YRDZ  [SOIC127P600X175-9N-S229]
R121  18k  [RESC1005X40N]
R122  24R9  Tolerance: ±0.01%  [RESC2012X60N]
R123  100  Tolerance: ±0.01%  Part Number: RNCF0805TKW100R  [RESC2012X60N]
R124  100  Tolerance: ±0.01%  Part Number: RNCF0805TKW100R  [RESC2012X60N]
R125  24R9  Tolerance: ±0.01%  [RESC2012X60N]
RN1  100R  [SOIC127P600X175-8N]  (parts A,B,C,D of 4)
RN2  10k  [SOIC127P600X175-8N]  (parts A,B,C,D of 4)
RN4  10k  [SOIC127P600X175-8N]  (parts A,B,C,D of 4)
U3  LTC5507ES6#TRMPBF  [FP-LTC5507ES6#TRMPBF-MFG]

### Ports
OFFSET_DAC_OUT (in), RF_IN (in), RF_PWR_OUT (out)

### Nets
GND: C79.1 C80.1 C81.1 C82.1 C84.1 IC17.8(~{DS}) IC18.8(~{DS}) R123.1 R124.1 RN1.4 RN1.8 RN2.4 RN4.2 U3.2(GND)
N12V0A: C80.2 C82.2 IC17.4(V-) IC17.9(EP) IC18.4(V-) IC18.9(EP)
P2V048_REF: RN2.3
P5V0A: C83.1 C84.2 R121.2 U3.4(VCC)
P12V0A: C79.2 C81.2 IC17.7(V+) IC18.7(V+)
DAC_OUT_OFFSET: RN2.2 ; port OFFSET_DAC_OUT
RF_IN: R123.2 R124.2 RN1.1 RN1.2 RN1.3 ; port RF_IN
RF_PWR_OUT: C78.2 IC18.6(OUT) RN4.1 ; port RF_PWR_OUT
NetC77_1: C77.1 IC17.2(IN-) RN2.7 RN2.8
NetC77_2: C77.2 IC17.6(OUT) RN2.1 RN4.3
NetC78_1: C78.1 IC18.2(IN-) RN4.7 RN4.8
NetC83_2: C83.2 U3.5(PCAP)
NetC85_1: C85.1 R122.2 R125.2 RN1.5
NetC85_2: C85.2 U3.6(RFIN)
NetIC17_3: IC17.3(IN+) RN2.5 RN2.6
NetIC18_3: IC18.3(IN+) RN4.5 RN4.6
NetR121_1: R121.1 U3.1(~{SHDN})
NetR122_1: R122.1 R125.1 RN1.6 RN1.7
NetRN4_4: RN4.4 U3.3(VOUT)

### Notes on the sheet
- (near RN2) add DAC filtering?
- attenuator made of low-tempco resistors
  calculated attenuation: 9.263dB
  additional 24.9R resistors for 50ohm matching - can be shorted for better tempco
- max LTC supply current:
  P5V0A: 5mA
  max AMP supply current:
  N12V0A: 2*70mA
  P12V0A: 2*70mA
- C_RRFIN = C_PCAP
  C_PCAP > 1/30*f_min [uF]
  f_min = 5MHz
  C_PCAP > 0.02[uF]
- 50ohm input load added as placeholder
- Project/Equipment
- Document
- Designer
- Drawn by
- Check.by
- Copyright WUT ISE 2021.
  This documentation describes Open Hardware and is licensed under the CERN OHL v.1.1. You may redistribute and modify this documentation under the terms of the CERN OHL v.1.1. (http://ohwr.org/CERNOHL). This documentation is distributed WITHOUT ANY EXPRESS OR IMPLIED WARRANTY, INCLUDING OF MERCHANTABILITY, SATISFACTORY QUALITY AND FITNESS FOR A PARTICULAR PURPOSE. Please see the CERN OHL v.1.1 for applicable conditions.
- Contact
- File
- Last Mod.
- Print Date
- Sheet
- Size
- A3
- of
- Rev
- (in symbol ADA4898-1YRDZ) PD
- (in symbol R0402_18K_1%_0.0625W_100PPM) 1%

### Library data of the parts
C77 C78 = CC1206_47PF_100V_5%_C0G: Non-polarised capacitor; Part Description: SMD Multilayer Chip Ceramic Capacitor; Manufacturer: GENERIC; Manufacturer1 Part Number: 12061A470JAT2A; Voltage: 100V; TC: C0G/NP0; Tolerance: ±5%; Part Number: CC1206_47PF_100V_5%_C0G; Component Kind: Standard; Component Type: Standard; Pin Count: 2; Value: 47pF; Status: Preferred; Manufacturer Part Number: CC1206_47PF_100V_5%_C0G; Case: 1206; Mounted: Yes; Socket: No; SMD: Yes; Sense: No; Manufacturer1 Example: AVX; Manufacturer1 ComponentHeight: 0.94mm; HelpURL: \\cern.ch\dfs\Applications\Altium\Datasheets\CC1206_C0G_AVX.pdf; Author: CERN DEM JLC; CreateDate: 06.11.2014; LatestRevisionDate: 06.11.2014
C79-C82 = CC0402_100NF_16V_10%_X7R: as C1 on sheet rf_detector_top; Part Number: CC0402_100NF_16V_10%_X7R; Component Kind: Standard; Component Type: Standard; Pin Count: 2; Value: 100nF; Status: Not Recommended; Manufacturer Part Number: CC0402_100NF_16V_10%_X7R; Case: 0402; Mounted: Yes; Socket: No; SMD: Yes; Sense: No; Manufacturer1 Example: MURATA; Manufacturer1 ComponentHeight: 0.55mm; HelpURL: \\cern.ch\dfs\Applications\Altium\Datasheets\CC0402_X7R_MURATA_GRM.pdf; Author: CERN DEM JLC; CreateDate: 05.12.2013; LatestRevisionDate: 03.12.2007
C83-C85 = CC0805_47NF_25V_5%_C0G: Non-polarised capacitor; Part Description: SMD Multilayer Chip Ceramic Capacitor; Manufacturer: GENERIC; Manufacturer1 Part Number: C0805C473J3GACTU; Tolerance: ±5%; Part Number: CC0805_47NF_25V_5%_C0G; Component Kind: Standard; Component Type: Standard; Pin Count: 2; Value: 47nF; Status: None; Manufacturer Part Number: CC0805_47NF_25V_5%_C0G; Case: 0805; Mounted: Yes; Socket: No; SMD: Yes; Sense: No; Manufacturer1 Example: KEMET; Manufacturer1 ComponentHeight: 1.4mm; HelpURL: \\cern.ch\dfs\Applications\Altium\Datasheets\CC0805_C0G_KEMET_(Commercial Grade).pdf; Author: CERN DEM JLC; CreateDate: 18/01/2011; LatestRevisionDate: 18/01/2011
IC17 IC18 = ADA4898-1YRDZ: High Voltage, Low Noise, Low Distortion, Unity-Gain Stable, High Speed Operational Amplifier; Part Description: Single, High Voltage, Low Noise, Low Distortion, Unity-Gain Stable, High Speed Operational Amplifier; Manufacturer: ANALOG DEVICES; PressFit: No; Bonding: No; Part Number: ADA4898-1YRDZ; Component Kind: Standard; Component Type: Standard; Device: ADA4898-1YRDZ; PackageDescription: SOIC, 1.27mm Pitch; 8 Pin, 3.90mm W X 4.90mm L X 1.75mm H body (w/Thermal Tab 2.29 X 2.29mm), IPC Medium Density; Manufacturer Part Number: ADA4898-1YRD; Pin Count: 9; Case: SOIC8; Mounted: Yes; Socket: No; SMD: Yes; Sense: No; ComponentHeight: 1.75mm; Author: CERN DEM JLC; HelpURL: \\cern.ch\dfs\Applications\Altium\Datasheets\ADA4898-1YRDZ.pdf; CreateDate: 14.04.2014; LatestRevisionDate: 31.03.2022
R121 = R0402_18K_1%_0.0625W_100PPM: Resistor - 1%; Part Description: General Purpose Thick Film Chip Resistor; Manufacturer: GENERIC; Manufacturer1 Part Number: 232270671803L; TC: ±100ppm/°C; PressFit: No; Part Number: R0402_18K_1%_0.0625W_100PPM; Component Kind: Standard; Component Type: Standard; Pin Count: 2; Value: 18k; Status: Not Recommended; Power: 0.0625W; Tolerance: ±1%; Manufacturer Part Number: R0402_18K_1%_0.0625W_100PPM; Case: 0402; Mounted: Yes; Sense: No; Socket: No; SMD: Yes; Manufacturer1 Example: YAGEO PHYCOMP; Manufacturer1 ComponentHeight: 0.4mm; HelpURL: \\cern.ch\dfs\Applications\Altium\Datasheets\R0402_Phycomp_RC0402.pdf; Author: CERN DEM JLC; CreateDate: 03.12.2007; LatestRevisionDate: 17.10.2012
R122 R125 = R0805_24R9_0.1%_0.1W_10PPM: Resistor - 0.01%; Part Number: R0805_24R9_0.01%_0.1W_2PPM; Part Description: Thin Film Chip Resistor; Manufacturer: GENERIC; Manufacturer1 Part Number: RU73X2A24R9LTDF; Power: 0.1W; TC: ±2pm; PressFit: No; Component Kind: Standard; Component Type: Standard; Pin Count: 2; Value: 24R9; Status: Not Recommended; Manufacturer Part Number: R0805_24R9_0.01%_0.1W_2PPM; Case: 0805; Mounted: Yes; Sense: No; Socket: No; SMD: Yes; Manufacturer1 Example: TYCO HOLSWORTHY; Manufacturer1 ComponentHeight: 0.6mm; HelpURL: \\cern.ch\dfs\Applications\Altium\Datasheets\R0805_Tyco_RN73.pdf; Author: CERN DEM JLC; CreateDate: 03.12.2007; LatestRevisionDate: 13.03.2008
R123 R124 = R0805_100R_0.1%_0.1W_10PPM: Resistor - 0.01% / 2PPM; Part Description: Thin Film Chip Resistor; Manufacturer: GENERIC; Manufacturer1 Part Number: RN73C2A100RBTG; Power: 0.1W; TC: ±10ppm; PressFit: No; Component Kind: Standard; Component Type: Standard; Pin Count: 2; Value: 100; Status: Not Recommended; Manufacturer Part Number: R0805_100R_0.1%_0.1W_10PPM; Case: 0805; Mounted: Yes; Sense: No; Socket: No; SMD: Yes; Manufacturer1 Example: TYCO HOLSWORTHY; Manufacturer1 ComponentHeight: 0.6mm; HelpURL: \\cern.ch\dfs\Applications\Altium\Datasheets\R0805_Tyco_RN73.pdf; Author: CERN DEM JLC; CreateDate: 03.12.2007; LatestRevisionDate: 13.03.2008
RN1 = RN_1K_1K_VISHAY_Y1747V0191QT9: DIL8 Resistor Network 4 Isolated Resistor 0.01%; Part Number: RN_100R_100R_VISHAY_Y1747V0178; Part Description: Ultra High Precision Z-Foil Surface Mount 4 Resistors Network, SMNZ Series; Manufacturer: VISHAY FOIL RESISTOR; Manufacturer Part Number: Y1747V0178; Power: 4x0.1W; TC: ±0.2ppm/°C; Tolerance: 0.02%; PressFit: No; Component Kind: Standard; Component Type: Standard; Pin Count: 8; Value: 100R; Sense: No; Case: SOIC8; Mounted: Yes; Socket: No; SMD: Yes; ComponentHeight: 1.86mm; HelpURL: \\cern.ch\dfs\Applications\Altium\Datasheets\RN_VISHAY_SMNZ.pdf; Author: CERN DEM JMW; CreateDate: 11.06.2019; LatestRevisionDate: 11.06.2019
RN2 RN4 = RN_10K_10K_VISHAY_Y1747V0008QT9: DIL8 Resistor Network 4 Isolated Resistor 0.01%; Part Description: Ultra High Precision Z-Foil Surface Mount 4 Resistors Network, SMNZ Series; Manufacturer: VISHAY FOIL RESISTOR; Power: 4x0.1W; TC: ±0.2ppm/°C; Tolerance: 0.02%; PressFit: No; Part Number: RN_10K_10K_VISHAY_Y1747V0008QT9; Component Kind: Standard; Component Type: Standard; Pin Count: 8; Value: 10k; Sense: No; Manufacturer Part Number: Y1747V0008QT9; Case: SOIC8; Mounted: Yes; Socket: No; SMD: Yes; ComponentHeight: 1.86mm; HelpURL: \\cern.ch\dfs\Applications\Altium\Datasheets\RN_VISHAY_SMNZ.pdf; Author: CERN DEM BC; CreateDate: 02.09.2019; LatestRevisionDate: 02.09.2019
U3 = CMP-09141-000004-1: IC RF DETECT 100KHZ-1GHZ TSOT23; Manufacturer: Analog Devices; Standoff Height: 0.01mm; Max Junction Temp: +125°C; Max Frequency: 1000MHz; Bandwidth: 999.9MHz; Temperature Range Low: -40°C; ComponentLink2URL: https://www.analog.com/media/en/technical-documentation/data-sheets/5507f.pdf; Automotive: No; Device Class L2: RF Semiconductors and Devices; Height: 1mm; RoHS: TRUE; Mouser Description: RF Detector 0.1MHz to 1000MHz 14dBm Automotive 6-Pin TSOT-23 T/R; Lead Free: Yes; Temperature Range High: +85°C; Device Class L3: unset; Category: IC; Octopart: https://octopart.com/ltc5507es6%23trmpbf-analog+devices-88320008; Digikey Description: IC RF DETECT 100KHZ-1GHZ TSOT23; Package: TSOT-23; Temperature: -40°C to +85°C; ComponentLink2Description: Datasheet; Device Class L1: Integrated Circuits (ICs); Manufacturer Part Number: LTC5507ES6#TRMPBF; Ipc Land Pattern Name: SOT95P280X91-6